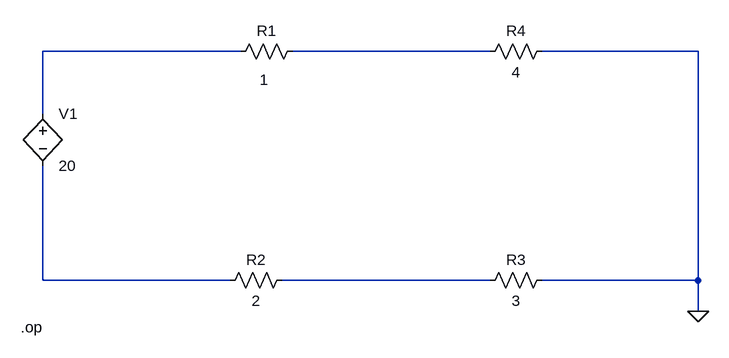
[diagram p0: schematic Draft1.asc]
Draft1.asc, the LTspice schematic file:
Version 4
SHEET 1 880 680
WIRE -144 -32 -448 -32
WIRE 240 -32 -64 -32
WIRE 560 -32 320 -32
WIRE -448 64 -448 -32
WIRE -448 320 -448 144
WIRE -160 320 -448 320
WIRE 240 320 -80 320
WIRE 560 320 560 -32
WIRE 560 320 320 320
WIRE 560 368 560 320
FLAG 560 368 0
SYMBOL res -48 -48 R90
WINDOW 0 0 56 VBottom 2
WINDOW 3 44 60 VTop 2
SYMATTR InstName R1
SYMATTR Value 1
SYMBOL res -64 304 R90
WINDOW 0 0 56 VBottom 2
WINDOW 3 32 56 VTop 2
SYMATTR InstName R2
SYMATTR Value 2
SYMBOL res 336 304 R90
WINDOW 0 0 56 VBottom 2
WINDOW 3 32 56 VTop 2
SYMATTR InstName R3
SYMATTR Value 3
SYMBOL bv -448 48 R0
SYMATTR InstName V1
SYMATTR Value 20
SYMBOL res 336 -48 R90
WINDOW 0 0 56 VBottom 2
WINDOW 3 32 56 VTop 2
SYMATTR InstName R4
SYMATTR Value 4
TEXT -482 392 Left 2 !.op

The netlist it stands for:
* Draft1.asc
R1 N002 N001 1
R2 N004 N003 2
R3 0 N004 3
B§V1 N001 N003 20
R4 0 N002 4
.op
.backanno
.end